# Altium schematic sheet PowerPins_RK3399.SchDoc
size A3; SheetNumber: 6; SheetTotal: 7
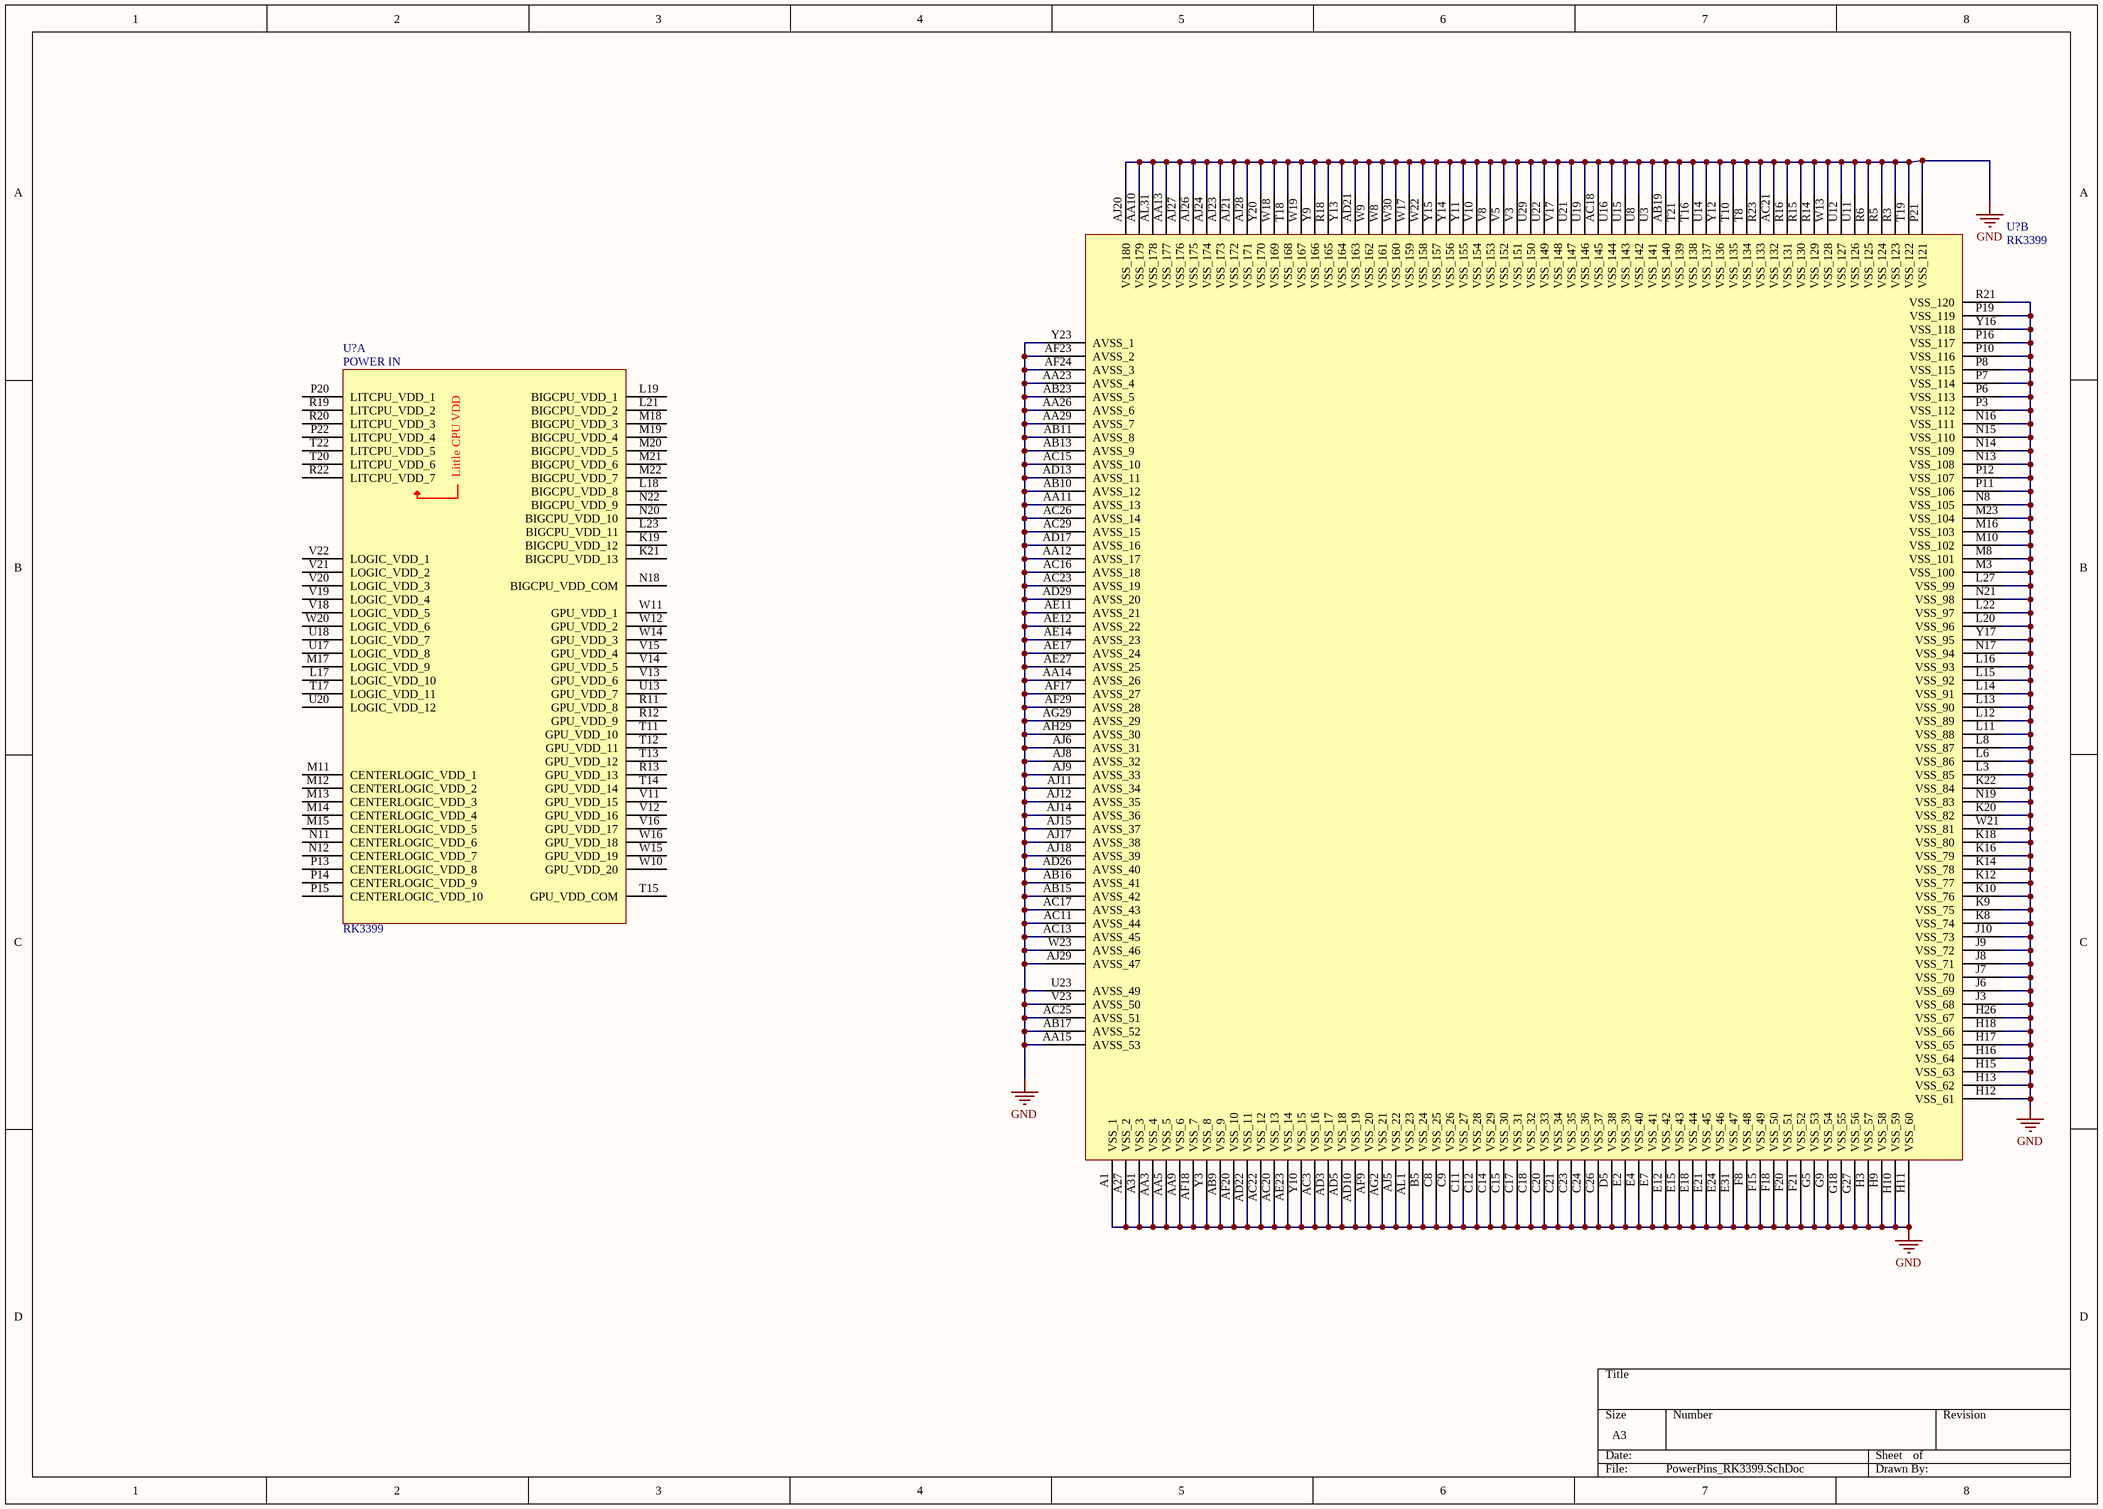
[diagram p0: PowerPins_RK3399.SchDoc]

## Parts
(Parts that share a designator on the sheet are numbered #1, #2 ... from top to bottom, then left to right.)
U?#1  RK3399  [BGA828_RK3399]  (part B of 24)
U?#2  RK3399  [BGA828_RK3399]  (part A of 24)

## Nets
GND: U?#1.A1(VSS_1) U?#1.A27(VSS_2) U?#1.A31(VSS_3) U?#1.AA3(VSS_4) U?#1.AA5(VSS_5) U?#1.AA9(VSS_6) U?#1.AA10(VSS_179) U?#1.AA11(AVSS_13) U?#1.AA12(AVSS_17) U?#1.AA13(VSS_177) U?#1.AA14(AVSS_26) U?#1.AA15(AVSS_53) U?#1.AA23(AVSS_4) U?#1.AA26(AVSS_6) U?#1.AA29(AVSS_7) U?#1.AB9(VSS_9) U?#1.AB10(AVSS_12) U?#1.AB11(AVSS_8) U?#1.AB13(AVSS_9) U?#1.AB15(AVSS_42) U?#1.AB16(AVSS_41) U?#1.AB17(AVSS_52) U?#1.AB19(VSS_140) U?#1.AB23(AVSS_5) U?#1.AC3(VSS_16) U?#1.AC11(AVSS_44) U?#1.AC13(AVSS_45) U?#1.AC15(AVSS_10) U?#1.AC16(AVSS_18) U?#1.AC17(AVSS_43) U?#1.AC18(VSS_145) U?#1.AC20(VSS_13) U?#1.AC21(VSS_132) U?#1.AC22(VSS_12) U?#1.AC23(AVSS_19) U?#1.AC25(AVSS_51) U?#1.AC26(AVSS_14) U?#1.AC29(AVSS_15) U?#1.AD3(VSS_17) U?#1.AD5(VSS_18) U?#1.AD10(VSS_19) U?#1.AD13(AVSS_11) U?#1.AD17(AVSS_16) U?#1.AD21(VSS_163) U?#1.AD22(VSS_11) U?#1.AD26(AVSS_40) U?#1.AD29(AVSS_20) U?#1.AE11(AVSS_21) U?#1.AE12(AVSS_22) U?#1.AE14(AVSS_23) U?#1.AE17(AVSS_24) U?#1.AE23(VSS_14) U?#1.AE27(AVSS_25) U?#1.AF9(VSS_20) U?#1.AF17(AVSS_27) U?#1.AF18(VSS_7) U?#1.AF20(VSS_10) U?#1.AF23(AVSS_2) U?#1.AF24(AVSS_3) U?#1.AF29(AVSS_28) U?#1.AG2(VSS_21) U?#1.AG29(AVSS_29) U?#1.AH29(AVSS_30) U?#1.AJ5(VSS_22) U?#1.AJ6(AVSS_31) U?#1.AJ8(AVSS_32) U?#1.AJ9(AVSS_33) U?#1.AJ11(AVSS_34) U?#1.AJ12(AVSS_35) U?#1.AJ14(AVSS_36) U?#1.AJ15(AVSS_37) U?#1.AJ17(AVSS_38) U?#1.AJ18(AVSS_39) U?#1.AJ20(VSS_180) U?#1.AJ21(VSS_172) U?#1.AJ23(VSS_173) U?#1.AJ24(VSS_174) U?#1.AJ26(VSS_175) U?#1.AJ27(VSS_176) U?#1.AJ28(VSS_171) U?#1.AJ29(AVSS_47) U?#1.AL1(VSS_23) U?#1.AL31(VSS_178) U?#1.B5(VSS_24) U?#1.C8(VSS_25) U?#1.C9(VSS_26) U?#1.C11(VSS_27) U?#1.C12(VSS_28) U?#1.C14(VSS_29) U?#1.C15(VSS_30) U?#1.C17(VSS_31) U?#1.C18(VSS_32) U?#1.C20(VSS_33) U?#1.C21(VSS_34) U?#1.C23(VSS_35) U?#1.C24(VSS_36) U?#1.C26(VSS_37) U?#1.D5(VSS_38) U?#1.E2(VSS_39) U?#1.E4(VSS_40) U?#1.E7(VSS_41) U?#1.E12(VSS_42) U?#1.E15(VSS_43) U?#1.E18(VSS_44) U?#1.E21(VSS_45) U?#1.E24(VSS_46) U?#1.E31(VSS_47) U?#1.F8(VSS_48) U?#1.F15(VSS_49) U?#1.F18(VSS_50) U?#1.F20(VSS_51) U?#1.F21(VSS_52) U?#1.G5(VSS_53) U?#1.G9(VSS_54) U?#1.G18(VSS_55) U?#1.G27(VSS_56) U?#1.H3(VSS_57) U?#1.H9(VSS_58) U?#1.H10(VSS_59) U?#1.H11(VSS_60) U?#1.H12(VSS_61) U?#1.H13(VSS_62) U?#1.H15(VSS_63) U?#1.H16(VSS_64) U?#1.H17(VSS_65) U?#1.H18(VSS_66) U?#1.H26(VSS_67) U?#1.J3(VSS_68) U?#1.J6(VSS_69) U?#1.J7(VSS_70) U?#1.J8(VSS_71) U?#1.J9(VSS_72) U?#1.J10(VSS_73) U?#1.K8(VSS_74) U?#1.K9(VSS_75) U?#1.K10(VSS_76) U?#1.K12(VSS_77) U?#1.K14(VSS_78) U?#1.K16(VSS_79) U?#1.K18(VSS_80) U?#1.K20(VSS_82) U?#1.K22(VSS_84) U?#1.L3(VSS_85) U?#1.L6(VSS_86) U?#1.L8(VSS_87) U?#1.L11(VSS_88) U?#1.L12(VSS_89) U?#1.L13(VSS_90) U?#1.L14(VSS_91) U?#1.L15(VSS_92) U?#1.L16(VSS_93) U?#1.L20(VSS_96) U?#1.L22(VSS_97) U?#1.L27(VSS_99) U?#1.M3(VSS_100) U?#1.M8(VSS_101) U?#1.M10(VSS_102) U?#1.M16(VSS_103) U?#1.M23(VSS_104) U?#1.N8(VSS_105) U?#1.N13(VSS_108) U?#1.N14(VSS_109) U?#1.N15(VSS_110) U?#1.N16(VSS_111) U?#1.N17(VSS_94) U?#1.N19(VSS_83) U?#1.N21(VSS_98) U?#1.P3(VSS_112) U?#1.P6(VSS_113) U?#1.P7(VSS_114) U?#1.P8(VSS_115) U?#1.P10(VSS_116) U?#1.P11(VSS_106) U?#1.P12(VSS_107) U?#1.P16(VSS_117) U?#1.P19(VSS_119) U?#1.P21(VSS_121) U?#1.R3(VSS_123) U?#1.R5(VSS_124) U?#1.R6(VSS_125) U?#1.R14(VSS_129) U?#1.R15(VSS_130) U?#1.R16(VSS_131) U?#1.R18(VSS_165) U?#1.R21(VSS_120) U?#1.R23(VSS_133) U?#1.T8(VSS_134) U?#1.T10(VSS_135) U?#1.T16(VSS_138) U?#1.T18(VSS_168) U?#1.T19(VSS_122) U?#1.T21(VSS_139) U?#1.U3(VSS_141) U?#1.U8(VSS_142) U?#1.U11(VSS_126) U?#1.U12(VSS_127) U?#1.U14(VSS_137) U?#1.U15(VSS_143) U?#1.U16(VSS_144) U?#1.U19(VSS_146) U?#1.U21(VSS_147) U?#1.U22(VSS_149) U?#1.U23(AVSS_49) U?#1.U29(VSS_150) U?#1.V3(VSS_151) U?#1.V5(VSS_152) U?#1.V8(VSS_153) U?#1.V10(VSS_154) U?#1.V17(VSS_148) U?#1.V23(AVSS_50) U?#1.W8(VSS_161) U?#1.W9(VSS_162) U?#1.W13(VSS_128) U?#1.W17(VSS_159) U?#1.W18(VSS_169) U?#1.W19(VSS_167) U?#1.W21(VSS_81) U?#1.W22(VSS_158) U?#1.W23(AVSS_46) U?#1.W30(VSS_160) U?#1.Y3(VSS_8) U?#1.Y9(VSS_166) U?#1.Y10(VSS_15) U?#1.Y11(VSS_155) U?#1.Y12(VSS_136) U?#1.Y13(VSS_164) U?#1.Y14(VSS_156) U?#1.Y15(VSS_157) U?#1.Y16(VSS_118) U?#1.Y17(VSS_95) U?#1.Y20(VSS_170) U?#1.Y23(AVSS_1)

Not connected (* = marked no-connect by the designer): U?#2 K19(BIGCPU_VDD_12) K21(BIGCPU_VDD_13) L17(LOGIC_VDD_10) L18(BIGCPU_VDD_8) L19(BIGCPU_VDD_1) L21(BIGCPU_VDD_2) L23(BIGCPU_VDD_11) M11(CENTERLOGIC_VDD_1) M12(CENTERLOGIC_VDD_2) M13(CENTERLOGIC_VDD_3) M14(CENTERLOGIC_VDD_4) M15(CENTERLOGIC_VDD_5) M17(LOGIC_VDD_9) M18(BIGCPU_VDD_3) M19(BIGCPU_VDD_4) M20(BIGCPU_VDD_5) M21(BIGCPU_VDD_6) M22(BIGCPU_VDD_7) N11(CENTERLOGIC_VDD_6) N12(CENTERLOGIC_VDD_7) N18(BIGCPU_VDD_COM) N20(BIGCPU_VDD_10) N22(BIGCPU_VDD_9) P13(CENTERLOGIC_VDD_8) P14(CENTERLOGIC_VDD_9) P15(CENTERLOGIC_VDD_10) P20(LITCPU_VDD_1) P22(LITCPU_VDD_4) R11(GPU_VDD_8) R12(GPU_VDD_9) R13(GPU_VDD_13) R19(LITCPU_VDD_2) R20(LITCPU_VDD_3) R22(LITCPU_VDD_7) T11(GPU_VDD_10) T12(GPU_VDD_11) T13(GPU_VDD_12) T14(GPU_VDD_14) T15(GPU_VDD_COM) T17(LOGIC_VDD_11) T20(LITCPU_VDD_6) T22(LITCPU_VDD_5) U13(GPU_VDD_7) U17(LOGIC_VDD_8) U18(LOGIC_VDD_7) U20(LOGIC_VDD_12) V11(GPU_VDD_15) V12(GPU_VDD_16) V13(GPU_VDD_6) V14(GPU_VDD_5) V15(GPU_VDD_4) V16(GPU_VDD_17) V18(LOGIC_VDD_5) V19(LOGIC_VDD_4) V20(LOGIC_VDD_3) V21(LOGIC_VDD_2) V22(LOGIC_VDD_1) W10(GPU_VDD_20) W11(GPU_VDD_1) W12(GPU_VDD_2) W14(GPU_VDD_3) W15(GPU_VDD_19) W16(GPU_VDD_18) W20(LOGIC_VDD_6)

## Notes on the sheet
- (in symbol IC_RK3399-FCBGA828, part A) POWER IN; Little CPU VDD

## Library data of the parts
U?#1 U?#2 = IC_RK3399-FCBGA828: RK3399 is a low power, high performance processor for computing, personal mobile.; Manufacturer: Rockchip; Manufacturer Part Number: RK3399; Case/Package: FCBGA828; Supplier-1: Rockchip